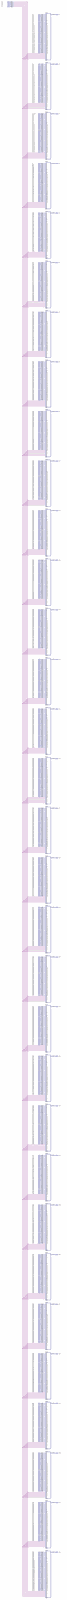
[diagram p0: schematic sheet, whole]
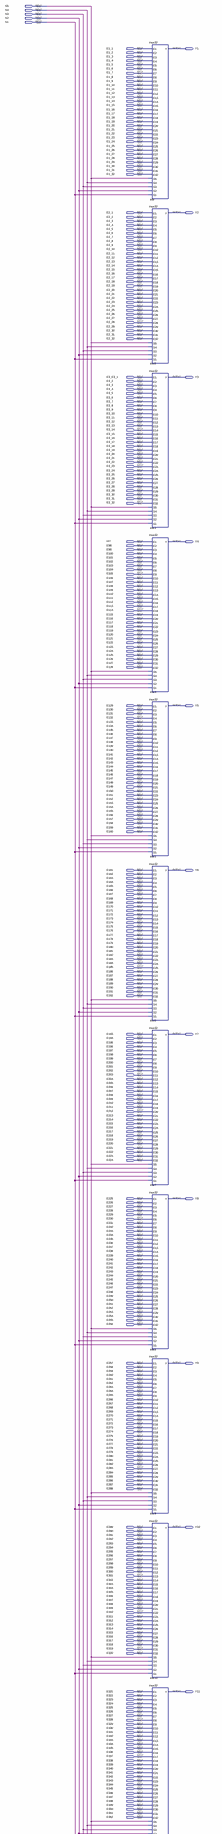
[diagram p1: schematic sheet, upper part]
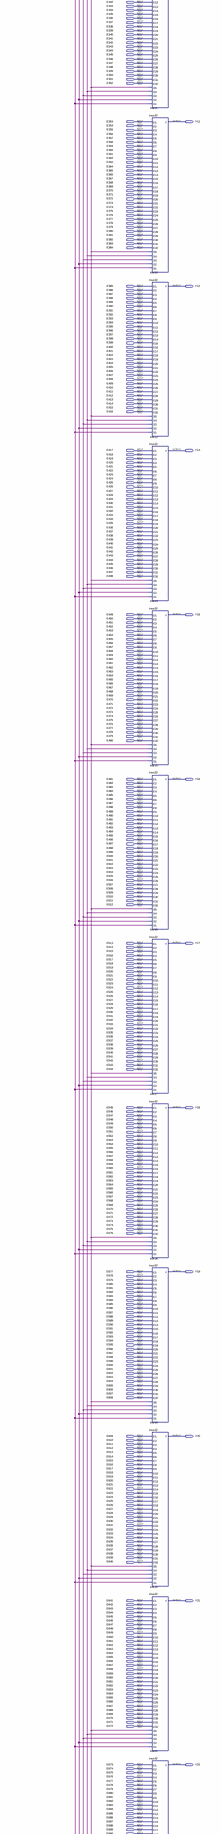
[diagram p2: schematic sheet, middle part]
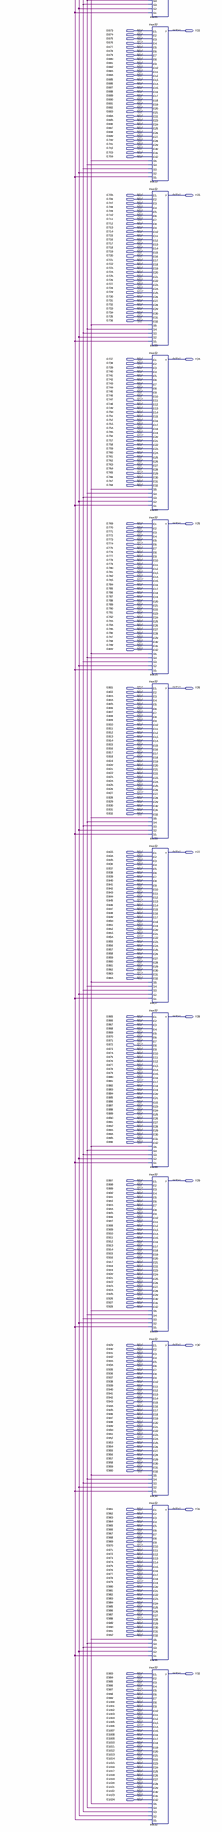
[diagram p3: schematic sheet, lower part]
// Quartus schematic mux32x32.bdf as structural Verilog: 32 symbols, 1061 pins
module mux32x32 (
  input  S5,
  input  S4,
  input  S3,
  input  S2,
  input  S1,
  input  E1_1,
  input  E1_2,
  input  E1_3,
  input  E1_4,
  input  E1_5,
  input  E1_6,
  input  E1_7,
  input  E1_8,
  input  E1_9,
  input  E1_10,
  input  E1_11,
  input  E1_12,
  input  E1_13,
  input  E1_14,
  input  E1_15,
  input  E1_16,
  input  E1_17,
  input  E1_18,
  input  E1_19,
  input  E1_20,
  input  E1_21,
  input  E1_22,
  input  E1_23,
  input  E1_24,
  input  E1_25,
  input  E1_26,
  input  E1_27,
  input  E1_28,
  input  E1_29,
  input  E1_30,
  input  E1_31,
  input  E1_32,
  input  E2_1,
  input  E2_2,
  input  E2_3,
  input  E2_4,
  input  E2_5,
  input  E2_6,
  input  E2_7,
  input  E2_8,
  input  E2_9,
  input  E2_10,
  input  E2_11,
  input  E2_12,
  input  E2_13,
  input  E2_14,
  input  E2_15,
  input  E2_16,
  input  E2_17,
  input  E2_18,
  input  E2_19,
  input  E2_20,
  input  E2_21,
  input  E2_22,
  input  E2_23,
  input  E2_24,
  input  E2_25,
  input  E2_26,
  input  E2_27,
  input  E2_28,
  input  E2_29,
  input  E2_30,
  input  E2_31,
  input  E2_32,
  input  E3_E3_1,
  input  E3_2,
  input  E3_3,
  input  E3_4,
  input  E3_5,
  input  E3_6,
  input  E3_7,
  input  E3_8,
  input  E3_9,
  input  E3_10,
  input  E3_11,
  input  E3_12,
  input  E3_13,
  input  E3_14,
  input  E3_15,
  input  E3_16,
  input  E3_17,
  input  E3_18,
  input  E3_19,
  input  E3_20,
  input  E3_21,
  input  E3_22,
  input  E3_23,
  input  E3_24,
  input  E3_25,
  input  E3_26,
  input  E3_27,
  input  E3_28,
  input  E3_29,
  input  E3_30,
  input  E3_31,
  input  E3_32,
  input  E97,
  input  E98,
  input  E99,
  input  E100,
  input  E101,
  input  E102,
  input  E103,
  input  E104,
  input  E105,
  input  E106,
  input  E107,
  input  E108,
  input  E109,
  input  E110,
  input  E111,
  input  E112,
  input  E113,
  input  E114,
  input  E115,
  input  E116,
  input  E117,
  input  E118,
  input  E119,
  input  E120,
  input  E121,
  input  E122,
  input  E123,
  input  E124,
  input  E125,
  input  E126,
  input  E127,
  input  E128,
  input  E129,
  input  E130,
  input  E131,
  input  E132,
  input  E133,
  input  E134,
  input  E135,
  input  E136,
  input  E137,
  input  E138,
  input  E139,
  input  E140,
  input  E141,
  input  E142,
  input  E143,
  input  E144,
  input  E145,
  input  E146,
  input  E147,
  input  E148,
  input  E149,
  input  E150,
  input  E151,
  input  E152,
  input  E153,
  input  E154,
  input  E155,
  input  E156,
  input  E157,
  input  E158,
  input  E159,
  input  E160,
  input  E161,
  input  E162,
  input  E163,
  input  E164,
  input  E165,
  input  E166,
  input  E167,
  input  E168,
  input  E169,
  input  E170,
  input  E171,
  input  E172,
  input  E173,
  input  E174,
  input  E175,
  input  E176,
  input  E177,
  input  E178,
  input  E179,
  input  E180,
  input  E181,
  input  E182,
  input  E183,
  input  E184,
  input  E185,
  input  E186,
  input  E187,
  input  E188,
  input  E189,
  input  E190,
  input  E191,
  input  E192,
  input  E193,
  input  E194,
  input  E195,
  input  E196,
  input  E197,
  input  E198,
  input  E199,
  input  E200,
  input  E201,
  input  E202,
  input  E203,
  input  E204,
  input  E205,
  input  E206,
  input  E207,
  input  E208,
  input  E209,
  input  E210,
  input  E211,
  input  E212,
  input  E213,
  input  E214,
  input  E215,
  input  E216,
  input  E217,
  input  E218,
  input  E219,
  input  E220,
  input  E221,
  input  E222,
  input  E223,
  input  E224,
  input  E225,
  input  E226,
  input  E227,
  input  E228,
  input  E229,
  input  E230,
  input  E231,
  input  E232,
  input  E233,
  input  E234,
  input  E235,
  input  E236,
  input  E237,
  input  E238,
  input  E239,
  input  E240,
  input  E241,
  input  E242,
  input  E243,
  input  E244,
  input  E245,
  input  E246,
  input  E247,
  input  E248,
  input  E249,
  input  E250,
  input  E251,
  input  E252,
  input  E253,
  input  E254,
  input  E255,
  input  E256,
  input  E257,
  input  E258,
  input  E259,
  input  E260,
  input  E261,
  input  E262,
  input  E263,
  input  E264,
  input  E265,
  input  E266,
  input  E267,
  input  E268,
  input  E269,
  input  E270,
  input  E271,
  input  E272,
  input  E273,
  input  E274,
  input  E275,
  input  E276,
  input  E277,
  input  E278,
  input  E279,
  input  E280,
  input  E281,
  input  E282,
  input  E283,
  input  E284,
  input  E285,
  input  E286,
  input  E287,
  input  E288,
  input  E289,
  input  E290,
  input  E291,
  input  E292,
  input  E293,
  input  E294,
  input  E295,
  input  E296,
  input  E297,
  input  E298,
  input  E299,
  input  E300,
  input  E301,
  input  E302,
  input  E303,
  input  E304,
  input  E305,
  input  E306,
  input  E307,
  input  E308,
  input  E309,
  input  E310,
  input  E311,
  input  E312,
  input  E313,
  input  E314,
  input  E315,
  input  E316,
  input  E317,
  input  E318,
  input  E319,
  input  E320,
  input  E321,
  input  E322,
  input  E323,
  input  E324,
  input  E325,
  input  E326,
  input  E327,
  input  E328,
  input  E329,
  input  E330,
  input  E331,
  input  E332,
  input  E333,
  input  E334,
  input  E335,
  input  E336,
  input  E337,
  input  E338,
  input  E339,
  input  E340,
  input  E341,
  input  E342,
  input  E343,
  input  E344,
  input  E345,
  input  E346,
  input  E347,
  input  E348,
  input  E349,
  input  E350,
  input  E351,
  input  E352,
  input  E353,
  input  E354,
  input  E355,
  input  E356,
  input  E357,
  input  E358,
  input  E359,
  input  E360,
  input  E361,
  input  E362,
  input  E363,
  input  E364,
  input  E365,
  input  E366,
  input  E367,
  input  E368,
  input  E369,
  input  E370,
  input  E371,
  input  E372,
  input  E373,
  input  E374,
  input  E375,
  input  E376,
  input  E377,
  input  E378,
  input  E379,
  input  E380,
  input  E381,
  input  E382,
  input  E383,
  input  E384,
  input  E385,
  input  E386,
  input  E387,
  input  E388,
  input  E389,
  input  E390,
  input  E391,
  input  E392,
  input  E393,
  input  E394,
  input  E395,
  input  E396,
  input  E397,
  input  E398,
  input  E399,
  input  E400,
  input  E401,
  input  E402,
  input  E403,
  input  E404,
  input  E405,
  input  E406,
  input  E407,
  input  E408,
  input  E409,
  input  E410,
  input  E411,
  input  E412,
  input  E413,
  input  E414,
  input  E415,
  input  E416,
  input  E417,
  input  E418,
  input  E419,
  input  E420,
  input  E421,
  input  E422,
  input  E423,
  input  E424,
  input  E425,
  input  E426,
  input  E427,
  input  E428,
  input  E429,
  input  E430,
  input  E431,
  input  E432,
  input  E433,
  input  E434,
  input  E435,
  input  E436,
  input  E437,
  input  E438,
  input  E439,
  input  E440,
  input  E441,
  input  E442,
  input  E443,
  input  E444,
  input  E445,
  input  E446,
  input  E447,
  input  E448,
  input  E449,
  input  E450,
  input  E451,
  input  E452,
  input  E453,
  input  E454,
  input  E455,
  input  E456,
  input  E457,
  input  E458,
  input  E459,
  input  E460,
  input  E461,
  input  E462,
  input  E463,
  input  E464,
  input  E465,
  input  E466,
  input  E467,
  input  E468,
  input  E469,
  input  E470,
  input  E471,
  input  E472,
  input  E473,
  input  E474,
  input  E475,
  input  E476,
  input  E477,
  input  E478,
  input  E479,
  input  E480,
  input  E481,
  input  E482,
  input  E483,
  input  E484,
  input  E485,
  input  E486,
  input  E487,
  input  E488,
  input  E489,
  input  E490,
  input  E491,
  input  E492,
  input  E493,
  input  E494,
  input  E495,
  input  E496,
  input  E497,
  input  E498,
  input  E499,
  input  E500,
  input  E501,
  input  E502,
  input  E503,
  input  E504,
  input  E505,
  input  E506,
  input  E507,
  input  E508,
  input  E509,
  input  E510,
  input  E511,
  input  E512,
  input  E513,
  input  E514,
  input  E515,
  input  E516,
  input  E517,
  input  E518,
  input  E519,
  input  E520,
  input  E521,
  input  E522,
  input  E523,
  input  E524,
  input  E525,
  input  E526,
  input  E527,
  input  E528,
  input  E529,
  input  E530,
  input  E531,
  input  E532,
  input  E533,
  input  E534,
  input  E535,
  input  E536,
  input  E537,
  input  E538,
  input  E539,
  input  E540,
  input  E541,
  input  E542,
  input  E543,
  input  E544,
  input  E545,
  input  E546,
  input  E547,
  input  E548,
  input  E549,
  input  E550,
  input  E551,
  input  E552,
  input  E553,
  input  E554,
  input  E555,
  input  E556,
  input  E557,
  input  E558,
  input  E559,
  input  E560,
  input  E561,
  input  E562,
  input  E563,
  input  E564,
  input  E565,
  input  E566,
  input  E567,
  input  E568,
  input  E569,
  input  E570,
  input  E571,
  input  E572,
  input  E573,
  input  E574,
  input  E575,
  input  E576,
  input  E577,
  input  E578,
  input  E579,
  input  E580,
  input  E581,
  input  E582,
  input  E583,
  input  E584,
  input  E585,
  input  E586,
  input  E587,
  input  E588,
  input  E589,
  input  E590,
  input  E591,
  input  E592,
  input  E593,
  input  E594,
  input  E595,
  input  E596,
  input  E597,
  input  E598,
  input  E599,
  input  E600,
  input  E601,
  input  E602,
  input  E603,
  input  E604,
  input  E605,
  input  E606,
  input  E607,
  input  E608,
  input  E609,
  input  E610,
  input  E611,
  input  E612,
  input  E613,
  input  E614,
  input  E615,
  input  E616,
  input  E617,
  input  E618,
  input  E619,
  input  E620,
  input  E621,
  input  E622,
  input  E623,
  input  E624,
  input  E625,
  input  E626,
  input  E627,
  input  E628,
  input  E629,
  input  E630,
  input  E631,
  input  E632,
  input  E633,
  input  E634,
  input  E635,
  input  E636,
  input  E637,
  input  E638,
  input  E639,
  input  E640,
  input  E641,
  input  E642,
  input  E643,
  input  E644,
  input  E645,
  input  E646,
  input  E647,
  input  E648,
  input  E649,
  input  E650,
  input  E651,
  input  E652,
  input  E653,
  input  E654,
  input  E655,
  input  E656,
  input  E657,
  input  E658,
  input  E659,
  input  E660,
  input  E661,
  input  E662,
  input  E663,
  input  E664,
  input  E665,
  input  E666,
  input  E667,
  input  E668,
  input  E669,
  input  E670,
  input  E671,
  input  E672,
  input  E673,
  input  E674,
  input  E675,
  input  E676,
  input  E677,
  input  E678,
  input  E679,
  input  E680,
  input  E681,
  input  E682,
  input  E683,
  input  E684,
  input  E685,
  input  E686,
  input  E687,
  input  E688,
  input  E689,
  input  E690,
  input  E691,
  input  E692,
  input  E693,
  input  E694,
  input  E695,
  input  E696,
  input  E697,
  input  E698,
  input  E699,
  input  E700,
  input  E701,
  input  E702,
  input  E703,
  input  E704,
  input  E705,
  input  E706,
  input  E707,
  input  E708,
  input  E709,
  input  E710,
  input  E711,
  input  E712,
  input  E713,
  input  E714,
  input  E715,
  input  E716,
  input  E717,
  input  E718,
  input  E719,
  input  E720,
  input  E721,
  input  E722,
  input  E723,
  input  E724,
  input  E725,
  input  E726,
  input  E727,
  input  E728,
  input  E729,
  input  E730,
  input  E731,
  input  E732,
  input  E733,
  input  E734,
  input  E735,
  input  E736,
  input  E737,
  input  E738,
  input  E739,
  input  E740,
  input  E741,
  input  E742,
  input  E743,
  input  E744,
  input  E745,
  input  E746,
  input  E747,
  input  E748,
  input  E749,
  input  E750,
  input  E751,
  input  E752,
  input  E753,
  input  E754,
  input  E755,
  input  E756,
  input  E757,
  input  E758,
  input  E759,
  input  E760,
  input  E761,
  input  E762,
  input  E763,
  input  E764,
  input  E765,
  input  E766,
  input  E767,
  input  E768,
  input  E769,
  input  E770,
  input  E771,
  input  E772,
  input  E773,
  input  E774,
  input  E775,
  input  E776,
  input  E777,
  input  E778,
  input  E779,
  input  E780,
  input  E781,
  input  E782,
  input  E783,
  input  E784,
  input  E785,
  input  E786,
  input  E787,
  input  E788,
  input  E789,
  input  E790,
  input  E791,
  input  E792,
  input  E793,
  input  E794,
  input  E795,
  input  E796,
  input  E797,
  input  E798,
  input  E799,
  input  E800,
  input  E801,
  input  E802,
  input  E803,
  input  E804,
  input  E805,
  input  E806,
  input  E807,
  input  E808,
  input  E809,
  input  E810,
  input  E811,
  input  E812,
  input  E813,
  input  E814,
  input  E815,
  input  E816,
  input  E817,
  input  E818,
  input  E819,
  input  E820,
  input  E821,
  input  E822,
  input  E823,
  input  E824,
  input  E825,
  input  E826,
  input  E827,
  input  E828,
  input  E829,
  input  E830,
  input  E831,
  input  E832,
  input  E833,
  input  E834,
  input  E835,
  input  E836,
  input  E837,
  input  E838,
  input  E839,
  input  E840,
  input  E841,
  input  E842,
  input  E843,
  input  E844,
  input  E845,
  input  E846,
  input  E847,
  input  E848,
  input  E849,
  input  E850,
  input  E851,
  input  E852,
  input  E853,
  input  E854,
  input  E855,
  input  E856,
  input  E857,
  input  E858,
  input  E859,
  input  E860,
  input  E861,
  input  E862,
  input  E863,
  input  E864,
  input  E865,
  input  E866,
  input  E867,
  input  E868,
  input  E869,
  input  E870,
  input  E871,
  input  E872,
  input  E873,
  input  E874,
  input  E875,
  input  E876,
  input  E877,
  input  E878,
  input  E879,
  input  E880,
  input  E881,
  input  E882,
  input  E883,
  input  E884,
  input  E885,
  input  E886,
  input  E887,
  input  E888,
  input  E889,
  input  E890,
  input  E891,
  input  E892,
  input  E893,
  input  E894,
  input  E895,
  input  E896,
  input  E897,
  input  E898,
  input  E899,
  input  E900,
  input  E901,
  input  E902,
  input  E903,
  input  E904,
  input  E905,
  input  E906,
  input  E907,
  input  E908,
  input  E909,
  input  E910,
  input  E911,
  input  E912,
  input  E913,
  input  E914,
  input  E915,
  input  E916,
  input  E917,
  input  E918,
  input  E919,
  input  E920,
  input  E921,
  input  E922,
  input  E923,
  input  E924,
  input  E925,
  input  E926,
  input  E927,
  input  E928,
  input  E929,
  input  E930,
  input  E931,
  input  E932,
  input  E933,
  input  E934,
  input  E935,
  input  E936,
  input  E937,
  input  E938,
  input  E939,
  input  E940,
  input  E941,
  input  E942,
  input  E943,
  input  E944,
  input  E945,
  input  E946,
  input  E947,
  input  E948,
  input  E949,
  input  E950,
  input  E951,
  input  E952,
  input  E953,
  input  E954,
  input  E955,
  input  E956,
  input  E957,
  input  E958,
  input  E959,
  input  E960,
  input  E961,
  input  E962,
  input  E963,
  input  E964,
  input  E965,
  input  E966,
  input  E967,
  input  E968,
  input  E969,
  input  E970,
  input  E971,
  input  E972,
  input  E973,
  input  E974,
  input  E975,
  input  E976,
  input  E977,
  input  E978,
  input  E979,
  input  E980,
  input  E981,
  input  E982,
  input  E983,
  input  E984,
  input  E985,
  input  E986,
  input  E987,
  input  E988,
  input  E989,
  input  E990,
  input  E991,
  input  E992,
  input  E993,
  input  E994,
  input  E995,
  input  E996,
  input  E997,
  input  E998,
  input  E999,
  input  E1000,
  input  E1001,
  input  E1002,
  input  E1003,
  input  E1004,
  input  E1005,
  input  E1006,
  input  E1007,
  input  E1008,
  input  E1009,
  input  E1010,
  input  E1011,
  input  E1012,
  input  E1013,
  input  E1014,
  input  E1015,
  input  E1016,
  input  E1017,
  input  E1018,
  input  E1019,
  input  E1020,
  input  E1021,
  input  E1022,
  input  E1023,
  input  E1024,
  output Y1,
  output Y2,
  output Y3,
  output Y4,
  output Y5,
  output Y6,
  output Y7,
  output Y8,
  output Y9,
  output Y10,
  output Y11,
  output Y12,
  output Y13,
  output Y14,
  output Y15,
  output Y16,
  output Y17,
  output Y18,
  output Y19,
  output Y20,
  output Y21,
  output Y22,
  output Y23,
  output Y24,
  output Y25,
  output Y26,
  output Y27,
  output Y28,
  output Y29,
  output Y30,
  output Y31,
  output Y32
);

  mux32 inst (
    .E1(E1_1), .E2(E1_2), .E3(E1_3), .E4(E1_4), .E5(E1_5), .E6(E1_6), .E7(E1_7), .E8(E1_8), .E9(E1_9),
    .E10(E1_10), .E11(E1_11), .E12(E1_12), .E13(E1_13), .E14(E1_14), .E15(E1_15), .E16(E1_16), .E17(E1_17),
    .E18(E1_18), .E19(E1_19), .E20(E1_20), .E21(E1_21), .E22(E1_22), .E23(E1_23), .E24(E1_24), .E25(E1_25),
    .E26(E1_26), .E27(E1_27), .E28(E1_28), .E29(E1_29), .E30(E1_30), .E31(E1_31), .E32(E1_32), .S5(S5),
    .S4(S4), .S3(S3), .S2(S2), .S1(S1), .Y(Y1));
  mux32 inst2 (
    .E1(E2_1), .E2(E2_2), .E3(E2_3), .E4(E2_4), .E5(E2_5), .E6(E2_6), .E7(E2_7), .E8(E2_8), .E9(E2_9),
    .E10(E2_10), .E11(E2_11), .E12(E2_12), .E13(E2_13), .E14(E2_14), .E15(E2_15), .E16(E2_16), .E17(E2_17),
    .E18(E2_18), .E19(E2_19), .E20(E2_20), .E21(E2_21), .E22(E2_22), .E23(E2_23), .E24(E2_24), .E25(E2_25),
    .E26(E2_26), .E27(E2_27), .E28(E2_28), .E29(E2_29), .E30(E2_30), .E31(E2_31), .E32(E2_32), .S5(S5),
    .S4(S4), .S3(S3), .S2(S2), .S1(S1), .Y(Y2));
  mux32 inst3 (
    .E1(E3_E3_1), .E2(E3_2), .E3(E3_3), .E4(E3_4), .E5(E3_5), .E6(E3_6), .E7(E3_7), .E8(E3_8), .E9(E3_9),
    .E10(E3_10), .E11(E3_11), .E12(E3_12), .E13(E3_13), .E14(E3_14), .E15(E3_15), .E16(E3_16), .E17(E3_17),
    .E18(E3_18), .E19(E3_19), .E20(E3_20), .E21(E3_21), .E22(E3_22), .E23(E3_23), .E24(E3_24), .E25(E3_25),
    .E26(E3_26), .E27(E3_27), .E28(E3_28), .E29(E3_29), .E30(E3_30), .E31(E3_31), .E32(E3_32), .S5(S5),
    .S4(S4), .S3(S3), .S2(S2), .S1(S1), .Y(Y3));
  mux32 inst4 (
    .E1(E97), .E2(E98), .E3(E99), .E4(E100), .E5(E101), .E6(E102), .E7(E103), .E8(E104), .E9(E105),
    .E10(E106), .E11(E107), .E12(E108), .E13(E109), .E14(E110), .E15(E111), .E16(E112), .E17(E113),
    .E18(E114), .E19(E115), .E20(E116), .E21(E117), .E22(E118), .E23(E119), .E24(E120), .E25(E121),
    .E26(E122), .E27(E123), .E28(E124), .E29(E125), .E30(E126), .E31(E127), .E32(E128), .S5(S5), .S4(S4),
    .S3(S3), .S2(S2), .S1(S1), .Y(Y4));
  mux32 inst5 (
    .E1(E129), .E2(E130), .E3(E131), .E4(E132), .E5(E133), .E6(E134), .E7(E135), .E8(E136), .E9(E137),
    .E10(E138), .E11(E139), .E12(E140), .E13(E141), .E14(E142), .E15(E143), .E16(E144), .E17(E145),
    .E18(E146), .E19(E147), .E20(E148), .E21(E149), .E22(E150), .E23(E151), .E24(E152), .E25(E153),
    .E26(E154), .E27(E155), .E28(E156), .E29(E157), .E30(E158), .E31(E159), .E32(E160), .S5(S5), .S4(S4),
    .S3(S3), .S2(S2), .S1(S1), .Y(Y5));
  mux32 inst6 (
    .E1(E161), .E2(E162), .E3(E163), .E4(E164), .E5(E165), .E6(E166), .E7(E167), .E8(E168), .E9(E169),
    .E10(E170), .E11(E171), .E12(E172), .E13(E173), .E14(E174), .E15(E175), .E16(E176), .E17(E177),
    .E18(E178), .E19(E179), .E20(E180), .E21(E181), .E22(E182), .E23(E183), .E24(E184), .E25(E185),
    .E26(E186), .E27(E187), .E28(E188), .E29(E189), .E30(E190), .E31(E191), .E32(E192), .S5(S5), .S4(S4),
    .S3(S3), .S2(S2), .S1(S1), .Y(Y6));
  mux32 inst7 (
    .E1(E193), .E2(E194), .E3(E195), .E4(E196), .E5(E197), .E6(E198), .E7(E199), .E8(E200), .E9(E201),
    .E10(E202), .E11(E203), .E12(E204), .E13(E205), .E14(E206), .E15(E207), .E16(E208), .E17(E209),
    .E18(E210), .E19(E211), .E20(E212), .E21(E213), .E22(E214), .E23(E215), .E24(E216), .E25(E217),
    .E26(E218), .E27(E219), .E28(E220), .E29(E221), .E30(E222), .E31(E223), .E32(E224), .S5(S5), .S4(S4),
    .S3(S3), .S2(S2), .S1(S1), .Y(Y7));
  mux32 inst8 (
    .E1(E225), .E2(E226), .E3(E227), .E4(E228), .E5(E229), .E6(E230), .E7(E231), .E8(E232), .E9(E233),
    .E10(E234), .E11(E235), .E12(E236), .E13(E237), .E14(E238), .E15(E239), .E16(E240), .E17(E241),
    .E18(E242), .E19(E243), .E20(E244), .E21(E245), .E22(E246), .E23(E247), .E24(E248), .E25(E249),
    .E26(E250), .E27(E251), .E28(E252), .E29(E253), .E30(E254), .E31(E255), .E32(E256), .S5(S5), .S4(S4),
    .S3(S3), .S2(S2), .S1(S1), .Y(Y8));
  mux32 inst9 (
    .E1(E257), .E2(E258), .E3(E259), .E4(E260), .E5(E261), .E6(E262), .E7(E263), .E8(E264), .E9(E265),
    .E10(E266), .E11(E267), .E12(E268), .E13(E269), .E14(E270), .E15(E271), .E16(E272), .E17(E273),
    .E18(E274), .E19(E275), .E20(E276), .E21(E277), .E22(E278), .E23(E279), .E24(E280), .E25(E281),
    .E26(E282), .E27(E283), .E28(E284), .E29(E285), .E30(E286), .E31(E287), .E32(E288), .S5(S5), .S4(S4),
    .S3(S3), .S2(S2), .S1(S1), .Y(Y9));
  mux32 inst10 (
    .E1(E289), .E2(E290), .E3(E291), .E4(E292), .E5(E293), .E6(E294), .E7(E295), .E8(E296), .E9(E297),
    .E10(E298), .E11(E299), .E12(E300), .E13(E301), .E14(E302), .E15(E303), .E16(E304), .E17(E305),
    .E18(E306), .E19(E307), .E20(E308), .E21(E309), .E22(E310), .E23(E311), .E24(E312), .E25(E313),
    .E26(E314), .E27(E315), .E28(E316), .E29(E317), .E30(E318), .E31(E319), .E32(E320), .S5(S5), .S4(S4),
    .S3(S3), .S2(S2), .S1(S1), .Y(Y10));
  mux32 inst11 (
    .E1(E321), .E2(E322), .E3(E323), .E4(E324), .E5(E325), .E6(E326), .E7(E327), .E8(E328), .E9(E329),
    .E10(E330), .E11(E331), .E12(E332), .E13(E333), .E14(E334), .E15(E335), .E16(E336), .E17(E337),
    .E18(E338), .E19(E339), .E20(E340), .E21(E341), .E22(E342), .E23(E343), .E24(E344), .E25(E345),
    .E26(E346), .E27(E347), .E28(E348), .E29(E349), .E30(E350), .E31(E351), .E32(E352), .S5(S5), .S4(S4),
    .S3(S3), .S2(S2), .S1(S1), .Y(Y11));
  mux32 inst12 (
    .E1(E353), .E2(E354), .E3(E355), .E4(E356), .E5(E357), .E6(E358), .E7(E359), .E8(E360), .E9(E361),
    .E10(E362), .E11(E363), .E12(E364), .E13(E365), .E14(E366), .E15(E367), .E16(E368), .E17(E369),
    .E18(E370), .E19(E371), .E20(E372), .E21(E373), .E22(E374), .E23(E375), .E24(E376), .E25(E377),
    .E26(E378), .E27(E379), .E28(E380), .E29(E381), .E30(E382), .E31(E383), .E32(E384), .S5(S5), .S4(S4),
    .S3(S3), .S2(S2), .S1(S1), .Y(Y12));
  mux32 inst13 (
    .E1(E385), .E2(E386), .E3(E387), .E4(E388), .E5(E389), .E6(E390), .E7(E391), .E8(E392), .E9(E393),
    .E10(E394), .E11(E395), .E12(E396), .E13(E397), .E14(E398), .E15(E399), .E16(E400), .E17(E401),
    .E18(E402), .E19(E403), .E20(E404), .E21(E405), .E22(E406), .E23(E407), .E24(E408), .E25(E409),
    .E26(E410), .E27(E411), .E28(E412), .E29(E413), .E30(E414), .E31(E415), .E32(E416), .S5(S5), .S4(S4),
    .S3(S3), .S2(S2), .S1(S1), .Y(Y13));
  mux32 inst14 (
    .E1(E417), .E2(E418), .E3(E419), .E4(E420), .E5(E421), .E6(E422), .E7(E423), .E8(E424), .E9(E425),
    .E10(E426), .E11(E427), .E12(E428), .E13(E429), .E14(E430), .E15(E431), .E16(E432), .E17(E433),
    .E18(E434), .E19(E435), .E20(E436), .E21(E437), .E22(E438), .E23(E439), .E24(E440), .E25(E441),
    .E26(E442), .E27(E443), .E28(E444), .E29(E445), .E30(E446), .E31(E447), .E32(E448), .S5(S5), .S4(S4),
    .S3(S3), .S2(S2), .S1(S1), .Y(Y14));
  mux32 inst15 (
    .E1(E449), .E2(E450), .E3(E451), .E4(E452), .E5(E453), .E6(E454), .E7(E455), .E8(E456), .E9(E457),
    .E10(E458), .E11(E459), .E12(E460), .E13(E461), .E14(E462), .E15(E463), .E16(E464), .E17(E465),
    .E18(E466), .E19(E467), .E20(E468), .E21(E469), .E22(E470), .E23(E471), .E24(E472), .E25(E473),
    .E26(E474), .E27(E475), .E28(E476), .E29(E477), .E30(E478), .E31(E479), .E32(E480), .S5(S5), .S4(S4),
    .S3(S3), .S2(S2), .S1(S1), .Y(Y15));
  mux32 inst16 (
    .E1(E481), .E2(E482), .E3(E483), .E4(E484), .E5(E485), .E6(E486), .E7(E487), .E8(E488), .E9(E489),
    .E10(E490), .E11(E491), .E12(E492), .E13(E493), .E14(E494), .E15(E495), .E16(E496), .E17(E497),
    .E18(E498), .E19(E499), .E20(E500), .E21(E501), .E22(E502), .E23(E503), .E24(E504), .E25(E505),
    .E26(E506), .E27(E507), .E28(E508), .E29(E509), .E30(E510), .E31(E511), .E32(E512), .S5(S5), .S4(S4),
    .S3(S3), .S2(S2), .S1(S1), .Y(Y16));
  mux32 inst17 (
    .E1(E513), .E2(E514), .E3(E515), .E4(E516), .E5(E517), .E6(E518), .E7(E519), .E8(E520), .E9(E521),
    .E10(E522), .E11(E523), .E12(E524), .E13(E525), .E14(E526), .E15(E527), .E16(E528), .E17(E529),
    .E18(E530), .E19(E531), .E20(E532), .E21(E533), .E22(E534), .E23(E535), .E24(E536), .E25(E537),
    .E26(E538), .E27(E539), .E28(E540), .E29(E541), .E30(E542), .E31(E543), .E32(E544), .S5(S5), .S4(S4),
    .S3(S3), .S2(S2), .S1(S1), .Y(Y17));
  mux32 inst18 (
    .E1(E545), .E2(E546), .E3(E547), .E4(E548), .E5(E549), .E6(E550), .E7(E551), .E8(E552), .E9(E553),
    .E10(E554), .E11(E555), .E12(E556), .E13(E557), .E14(E558), .E15(E559), .E16(E560), .E17(E561),
    .E18(E562), .E19(E563), .E20(E564), .E21(E565), .E22(E566), .E23(E567), .E24(E568), .E25(E569),
    .E26(E570), .E27(E571), .E28(E572), .E29(E573), .E30(E574), .E31(E575), .E32(E576), .S5(S5), .S4(S4),
    .S3(S3), .S2(S2), .S1(S1), .Y(Y18));
  mux32 inst19 (
    .E1(E577), .E2(E578), .E3(E579), .E4(E580), .E5(E581), .E6(E582), .E7(E583), .E8(E584), .E9(E585),
    .E10(E586), .E11(E587), .E12(E588), .E13(E589), .E14(E590), .E15(E591), .E16(E592), .E17(E593),
    .E18(E594), .E19(E595), .E20(E596), .E21(E597), .E22(E598), .E23(E599), .E24(E600), .E25(E601),
    .E26(E602), .E27(E603), .E28(E604), .E29(E605), .E30(E606), .E31(E607), .E32(E608), .S5(S5), .S4(S4),
    .S3(S3), .S2(S2), .S1(S1), .Y(Y19));
  mux32 inst20 (
    .E1(E609), .E2(E610), .E3(E611), .E4(E612), .E5(E613), .E6(E614), .E7(E615), .E8(E616), .E9(E617),
    .E10(E618), .E11(E619), .E12(E620), .E13(E621), .E14(E622), .E15(E623), .E16(E624), .E17(E625),
    .E18(E626), .E19(E627), .E20(E628), .E21(E629), .E22(E630), .E23(E631), .E24(E632), .E25(E633),
    .E26(E634), .E27(E635), .E28(E636), .E29(E637), .E30(E638), .E31(E639), .E32(E640), .S5(S5), .S4(S4),
    .S3(S3), .S2(S2), .S1(S1), .Y(Y20));
  mux32 inst21 (
    .E1(E641), .E2(E642), .E3(E643), .E4(E644), .E5(E645), .E6(E646), .E7(E647), .E8(E648), .E9(E649),
    .E10(E650), .E11(E651), .E12(E652), .E13(E653), .E14(E654), .E15(E655), .E16(E656), .E17(E657),
    .E18(E658), .E19(E659), .E20(E660), .E21(E661), .E22(E662), .E23(E663), .E24(E664), .E25(E665),
    .E26(E666), .E27(E667), .E28(E668), .E29(E669), .E30(E670), .E31(E671), .E32(E672), .S5(S5), .S4(S4),
    .S3(S3), .S2(S2), .S1(S1), .Y(Y21));
  mux32 inst22 (
    .E1(E673), .E2(E674), .E3(E675), .E4(E676), .E5(E677), .E6(E678), .E7(E679), .E8(E680), .E9(E681),
    .E10(E682), .E11(E683), .E12(E684), .E13(E685), .E14(E686), .E15(E687), .E16(E688), .E17(E689),
    .E18(E690), .E19(E691), .E20(E692), .E21(E693), .E22(E694), .E23(E695), .E24(E696), .E25(E697),
    .E26(E698), .E27(E699), .E28(E700), .E29(E701), .E30(E702), .E31(E703), .E32(E704), .S5(S5), .S4(S4),
    .S3(S3), .S2(S2), .S1(S1), .Y(Y22));
  mux32 inst23 (
    .E1(E705), .E2(E706), .E3(E707), .E4(E708), .E5(E709), .E6(E710), .E7(E711), .E8(E712), .E9(E713),
    .E10(E714), .E11(E715), .E12(E716), .E13(E717), .E14(E718), .E15(E719), .E16(E720), .E17(E721),
    .E18(E722), .E19(E723), .E20(E724), .E21(E725), .E22(E726), .E23(E727), .E24(E728), .E25(E729),
    .E26(E730), .E27(E731), .E28(E732), .E29(E733), .E30(E734), .E31(E735), .E32(E736), .S5(S5), .S4(S4),
    .S3(S3), .S2(S2), .S1(S1), .Y(Y23));
  mux32 inst24 (
    .E1(E737), .E2(E738), .E3(E739), .E4(E740), .E5(E741), .E6(E742), .E7(E743), .E8(E744), .E9(E745),
    .E10(E746), .E11(E747), .E12(E748), .E13(E749), .E14(E750), .E15(E751), .E16(E752), .E17(E753),
    .E18(E754), .E19(E755), .E20(E756), .E21(E757), .E22(E758), .E23(E759), .E24(E760), .E25(E761),
    .E26(E762), .E27(E763), .E28(E764), .E29(E765), .E30(E766), .E31(E767), .E32(E768), .S5(S5), .S4(S4),
    .S3(S3), .S2(S2), .S1(S1), .Y(Y24));
  mux32 inst25 (
    .E1(E769), .E2(E770), .E3(E771), .E4(E772), .E5(E773), .E6(E774), .E7(E775), .E8(E776), .E9(E777),
    .E10(E778), .E11(E779), .E12(E780), .E13(E781), .E14(E782), .E15(E783), .E16(E784), .E17(E785),
    .E18(E786), .E19(E787), .E20(E788), .E21(E789), .E22(E790), .E23(E791), .E24(E792), .E25(E793),
    .E26(E794), .E27(E795), .E28(E796), .E29(E797), .E30(E798), .E31(E799), .E32(E800), .S5(S5), .S4(S4),
    .S3(S3), .S2(S2), .S1(S1), .Y(Y25));
  mux32 inst26 (
    .E1(E801), .E2(E802), .E3(E803), .E4(E804), .E5(E805), .E6(E806), .E7(E807), .E8(E808), .E9(E809),
    .E10(E810), .E11(E811), .E12(E812), .E13(E813), .E14(E814), .E15(E815), .E16(E816), .E17(E817),
    .E18(E818), .E19(E819), .E20(E820), .E21(E821), .E22(E822), .E23(E823), .E24(E824), .E25(E825),
    .E26(E826), .E27(E827), .E28(E828), .E29(E829), .E30(E830), .E31(E831), .E32(E832), .S5(S5), .S4(S4),
    .S3(S3), .S2(S2), .S1(S1), .Y(Y26));
  mux32 inst27 (
    .E1(E833), .E2(E834), .E3(E835), .E4(E836), .E5(E837), .E6(E838), .E7(E839), .E8(E840), .E9(E841),
    .E10(E842), .E11(E843), .E12(E844), .E13(E845), .E14(E846), .E15(E847), .E16(E848), .E17(E849),
    .E18(E850), .E19(E851), .E20(E852), .E21(E853), .E22(E854), .E23(E855), .E24(E856), .E25(E857),
    .E26(E858), .E27(E859), .E28(E860), .E29(E861), .E30(E862), .E31(E863), .E32(E864), .S5(S5), .S4(S4),
    .S3(S3), .S2(S2), .S1(S1), .Y(Y27));
  mux32 inst28 (
    .E1(E865), .E2(E866), .E3(E867), .E4(E868), .E5(E869), .E6(E870), .E7(E871), .E8(E872), .E9(E873),
    .E10(E874), .E11(E875), .E12(E876), .E13(E877), .E14(E878), .E15(E879), .E16(E880), .E17(E881),
    .E18(E882), .E19(E883), .E20(E884), .E21(E885), .E22(E886), .E23(E887), .E24(E888), .E25(E889),
    .E26(E890), .E27(E891), .E28(E892), .E29(E893), .E30(E894), .E31(E895), .E32(E896), .S5(S5), .S4(S4),
    .S3(S3), .S2(S2), .S1(S1), .Y(Y28));
  mux32 inst29 (
    .E1(E897), .E2(E898), .E3(E899), .E4(E900), .E5(E901), .E6(E902), .E7(E903), .E8(E904), .E9(E905),
    .E10(E906), .E11(E907), .E12(E908), .E13(E909), .E14(E910), .E15(E911), .E16(E912), .E17(E913),
    .E18(E914), .E19(E915), .E20(E916), .E21(E917), .E22(E918), .E23(E919), .E24(E920), .E25(E921),
    .E26(E922), .E27(E923), .E28(E924), .E29(E925), .E30(E926), .E31(E927), .E32(E928), .S5(S5), .S4(S4),
    .S3(S3), .S2(S2), .S1(S1), .Y(Y29));
  mux32 inst30 (
    .E1(E929), .E2(E930), .E3(E931), .E4(E932), .E5(E933), .E6(E934), .E7(E935), .E8(E936), .E9(E937),
    .E10(E938), .E11(E939), .E12(E940), .E13(E941), .E14(E942), .E15(E943), .E16(E944), .E17(E945),
    .E18(E946), .E19(E947), .E20(E948), .E21(E949), .E22(E950), .E23(E951), .E24(E952), .E25(E953),
    .E26(E954), .E27(E955), .E28(E956), .E29(E957), .E30(E958), .E31(E959), .E32(E960), .S5(S5), .S4(S4),
    .S3(S3), .S2(S2), .S1(S1), .Y(Y30));
  mux32 inst31 (
    .E1(E961), .E2(E962), .E3(E963), .E4(E964), .E5(E965), .E6(E966), .E7(E967), .E8(E968), .E9(E969),
    .E10(E970), .E11(E971), .E12(E972), .E13(E973), .E14(E974), .E15(E975), .E16(E976), .E17(E977),
    .E18(E978), .E19(E979), .E20(E980), .E21(E981), .E22(E982), .E23(E983), .E24(E984), .E25(E985),
    .E26(E986), .E27(E987), .E28(E988), .E29(E989), .E30(E990), .E31(E991), .E32(E992), .S5(S5), .S4(S4),
    .S3(S3), .S2(S2), .S1(S1), .Y(Y31));
  mux32 inst32 (
    .E1(E993), .E2(E994), .E3(E995), .E4(E996), .E5(E997), .E6(E998), .E7(E999), .E8(E1000), .E9(E1001),
    .E10(E1002), .E11(E1003), .E12(E1004), .E13(E1005), .E14(E1006), .E15(E1007), .E16(E1008), .E17(E1009),
    .E18(E1010), .E19(E1011), .E20(E1012), .E21(E1013), .E22(E1014), .E23(E1015), .E24(E1016), .E25(E1017),
    .E26(E1018), .E27(E1019), .E28(E1020), .E29(E1021), .E30(E1022), .E31(E1023), .E32(E1024), .S5(S5),
    .S4(S4), .S3(S3), .S2(S2), .S1(S1), .Y(Y32));
endmodule
